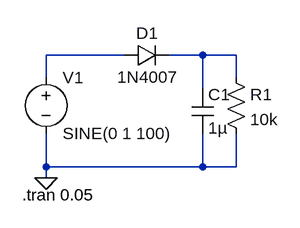
[diagram p0: schematic (1) Half wave rectifier with capacitor.asc]
(1) Half wave rectifier with capacitor.asc, the LTspice schematic file:
Version 4
SHEET 1 880 680
WIRE 144 96 32 96
WIRE 256 96 208 96
WIRE 304 96 256 96
WIRE 32 128 32 96
WIRE 304 128 304 96
WIRE 256 144 256 96
WIRE 32 256 32 208
WIRE 256 256 256 208
WIRE 256 256 32 256
WIRE 304 256 304 208
WIRE 304 256 256 256
WIRE 32 272 32 256
FLAG 32 272 0
SYMBOL diode 144 112 R270
WINDOW 0 32 32 VTop 2
WINDOW 3 0 32 VBottom 2
SYMATTR InstName D1
SYMATTR Value 1N4007
SYMBOL voltage 32 112 R0
WINDOW 123 0 0 Left 0
WINDOW 39 0 0 Left 0
SYMATTR InstName V1
SYMATTR Value SINE(0 1 100)
SYMBOL res 288 112 R0
SYMATTR InstName R1
SYMATTR Value 10k
SYMBOL cap 240 144 R0
SYMATTR InstName C1
SYMATTR Value 1µ
TEXT -2 296 Left 2 !.tran 0.05

The netlist it stands for:
* (1) Half wave rectifier with capacitor.asc
D1 N001 N002 1N4007
V1 N001 0 SINE(0 1 100)
R1 N002 0 10k
C1 N002 0 1µ
.model D D
.lib standard.dio
.tran 0.05
.backanno
.end